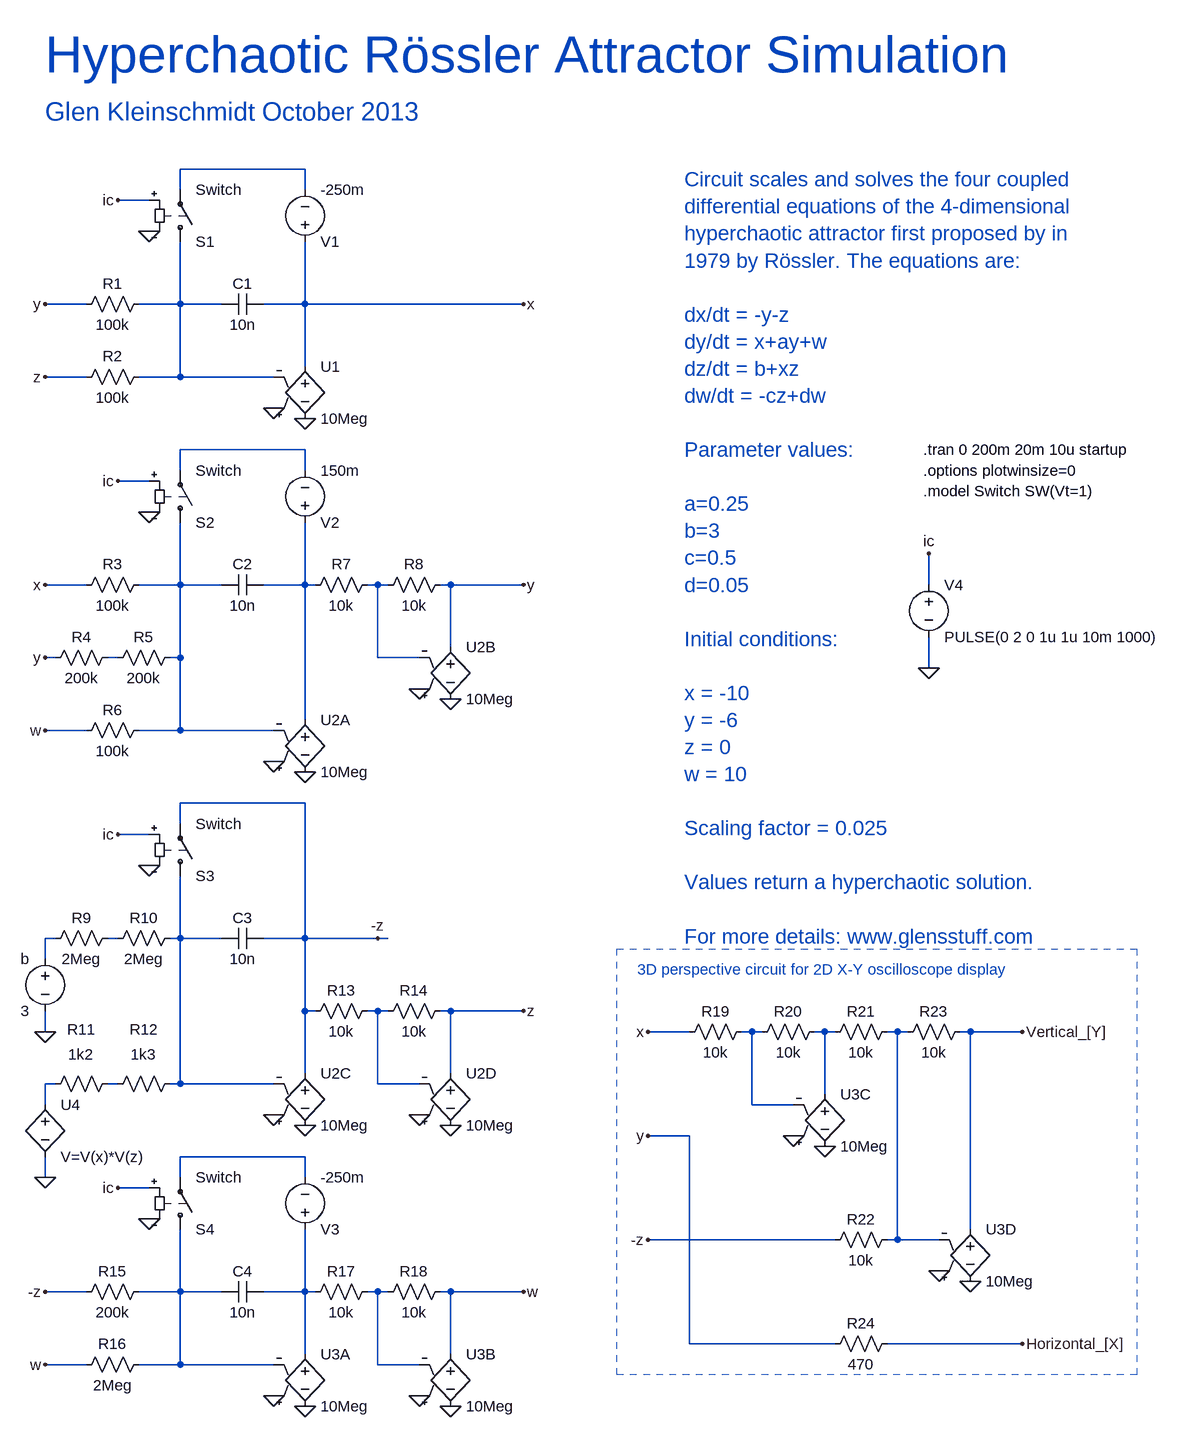
[diagram p0: schematic hyperroessler.asc]
hyperroessler.asc, the LTspice schematic file:
Version 4
SHEET 1 2788 2132
WIRE -912 -32 -1104 -32
WIRE -1104 0 -1104 -32
WIRE -912 0 -912 -32
WIRE -1152 16 -1200 16
WIRE -1248 176 -1312 176
WIRE -1104 176 -1104 80
WIRE -1104 176 -1168 176
WIRE -1040 176 -1104 176
WIRE -912 176 -912 80
WIRE -912 176 -976 176
WIRE -576 176 -912 176
WIRE -912 272 -912 176
WIRE -1248 288 -1312 288
WIRE -1104 288 -1104 176
WIRE -1104 288 -1168 288
WIRE -960 288 -1104 288
WIRE -912 400 -1104 400
WIRE -1104 432 -1104 400
WIRE -912 432 -912 400
WIRE -1152 448 -1200 448
WIRE -1248 608 -1312 608
WIRE -1104 608 -1104 512
WIRE -1104 608 -1168 608
WIRE -1040 608 -1104 608
WIRE -912 608 -912 512
WIRE -912 608 -976 608
WIRE -896 608 -912 608
WIRE -800 608 -816 608
WIRE -784 608 -800 608
WIRE -688 608 -704 608
WIRE -576 608 -688 608
WIRE 48 608 48 560
WIRE -688 704 -688 608
WIRE -1296 720 -1312 720
WIRE -1200 720 -1216 720
WIRE -1104 720 -1104 608
WIRE -1104 720 -1120 720
WIRE -800 720 -800 608
WIRE -736 720 -800 720
WIRE 48 736 48 688
WIRE -912 816 -912 608
WIRE -1248 832 -1312 832
WIRE -1104 832 -1104 720
WIRE -1104 832 -1168 832
WIRE -960 832 -1104 832
WIRE -912 944 -1104 944
WIRE -1104 976 -1104 944
WIRE -1152 992 -1200 992
WIRE -1296 1152 -1312 1152
WIRE -1200 1152 -1216 1152
WIRE -1104 1152 -1104 1056
WIRE -1104 1152 -1120 1152
WIRE -1040 1152 -1104 1152
WIRE -912 1152 -912 944
WIRE -912 1152 -976 1152
WIRE -800 1152 -912 1152
WIRE -784 1152 -800 1152
WIRE -1312 1184 -1312 1152
WIRE -912 1264 -912 1152
WIRE -896 1264 -912 1264
WIRE -800 1264 -816 1264
WIRE -784 1264 -800 1264
WIRE -688 1264 -704 1264
WIRE -576 1264 -688 1264
WIRE -1312 1296 -1312 1264
WIRE -320 1296 -384 1296
WIRE -224 1296 -240 1296
WIRE -208 1296 -224 1296
WIRE -112 1296 -128 1296
WIRE -96 1296 -112 1296
WIRE 0 1296 -16 1296
WIRE 16 1296 0 1296
WIRE 112 1296 96 1296
WIRE 192 1296 112 1296
WIRE -912 1360 -912 1264
WIRE -688 1360 -688 1264
WIRE -1296 1376 -1312 1376
WIRE -1200 1376 -1216 1376
WIRE -1104 1376 -1104 1152
WIRE -1104 1376 -1120 1376
WIRE -960 1376 -1104 1376
WIRE -800 1376 -800 1264
WIRE -736 1376 -800 1376
WIRE -112 1392 -112 1296
WIRE -1312 1408 -1312 1376
WIRE -224 1408 -224 1296
WIRE -160 1408 -224 1408
WIRE -320 1456 -384 1456
WIRE -912 1488 -1104 1488
WIRE -1312 1520 -1312 1488
WIRE -1104 1520 -1104 1488
WIRE -912 1520 -912 1488
WIRE -1152 1536 -1200 1536
WIRE 112 1600 112 1296
WIRE -96 1616 -384 1616
WIRE 0 1616 0 1296
WIRE 0 1616 -16 1616
WIRE 64 1616 0 1616
WIRE -1248 1696 -1312 1696
WIRE -1104 1696 -1104 1600
WIRE -1104 1696 -1168 1696
WIRE -1040 1696 -1104 1696
WIRE -912 1696 -912 1600
WIRE -912 1696 -976 1696
WIRE -896 1696 -912 1696
WIRE -800 1696 -816 1696
WIRE -784 1696 -800 1696
WIRE -688 1696 -704 1696
WIRE -576 1696 -688 1696
WIRE -320 1776 -320 1456
WIRE -96 1776 -320 1776
WIRE 192 1776 -16 1776
WIRE -912 1792 -912 1696
WIRE -688 1792 -688 1696
WIRE -1248 1808 -1312 1808
WIRE -1104 1808 -1104 1696
WIRE -1104 1808 -1168 1808
WIRE -960 1808 -1104 1808
WIRE -800 1808 -800 1696
WIRE -736 1808 -800 1808
FLAG -912 896 0
FLAG -960 880 0
FLAG -688 784 0
FLAG -736 768 0
FLAG -912 352 0
FLAG -960 336 0
FLAG -912 1440 0
FLAG -960 1424 0
FLAG -576 608 y
FLAG -1312 832 w
FLAG -1312 608 x
FLAG -1312 176 y
FLAG -1312 288 z
FLAG -1312 1520 0
FLAG -1312 1296 0
FLAG -1312 720 y
FLAG -688 1440 0
FLAG -736 1424 0
FLAG -576 1264 z
FLAG -912 1872 0
FLAG -960 1856 0
FLAG -688 1872 0
FLAG -736 1856 0
FLAG -576 1696 w
FLAG -1312 1808 w
FLAG -1312 1696 -z
FLAG -800 1152 -z
FLAG -1152 64 0
FLAG 48 736 0
FLAG -1152 496 0
FLAG -1152 1040 0
FLAG -1152 1584 0
FLAG -1200 16 ic
FLAG 48 560 ic
FLAG -1200 448 ic
FLAG -1200 992 ic
FLAG -1200 1536 ic
FLAG -576 176 x
FLAG -384 1296 x
FLAG 192 1296 Vertical_[Y]
FLAG -384 1616 -z
FLAG 192 1776 Horizontal_[X]
FLAG -384 1456 y
FLAG 112 1680 0
FLAG 64 1664 0
FLAG -112 1472 0
FLAG -160 1456 0
SYMBOL e2 -912 800 R0
SYMATTR InstName U2A
SYMATTR Value 10Meg
SYMBOL cap -976 592 R90
WINDOW 0 0 32 VBottom 2
WINDOW 3 32 32 VTop 2
SYMATTR InstName C2
SYMATTR Value 10n
SYMBOL res -1152 592 R90
WINDOW 0 0 56 VBottom 2
WINDOW 3 32 56 VTop 2
SYMATTR InstName R3
SYMATTR Value 100k
SYMBOL res -1152 816 R90
WINDOW 0 0 56 VBottom 2
WINDOW 3 32 56 VTop 2
SYMATTR InstName R6
SYMATTR Value 100k
SYMBOL e2 -688 688 R0
SYMATTR InstName U2B
SYMATTR Value 10Meg
SYMBOL res -800 592 R90
WINDOW 0 0 56 VBottom 2
WINDOW 3 32 56 VTop 2
SYMATTR InstName R7
SYMATTR Value 10k
SYMBOL res -688 592 R90
WINDOW 0 0 56 VBottom 2
WINDOW 3 32 56 VTop 2
SYMATTR InstName R8
SYMATTR Value 10k
SYMBOL e2 -912 256 R0
SYMATTR InstName U1
SYMATTR Value 10Meg
SYMBOL cap -976 160 R90
WINDOW 0 0 32 VBottom 2
WINDOW 3 32 32 VTop 2
SYMATTR InstName C1
SYMATTR Value 10n
SYMBOL res -1152 160 R90
WINDOW 0 0 56 VBottom 2
WINDOW 3 32 56 VTop 2
SYMATTR InstName R1
SYMATTR Value 100k
SYMBOL res -1152 272 R90
WINDOW 0 0 56 VBottom 2
WINDOW 3 32 56 VTop 2
SYMATTR InstName R2
SYMATTR Value 100k
SYMBOL e2 -912 1344 R0
SYMATTR InstName U2C
SYMATTR Value 10Meg
SYMBOL cap -976 1136 R90
WINDOW 0 0 32 VBottom 2
WINDOW 3 32 32 VTop 2
SYMATTR InstName C3
SYMATTR Value 10n
SYMBOL bv -1312 1392 R0
SYMATTR InstName U4
SYMATTR Value V=V(x)*V(z)
SYMBOL res -1200 1360 R90
WINDOW 0 -52 56 VBottom 2
WINDOW 3 -45 57 VTop 2
SYMATTR InstName R11
SYMATTR Value 1k2
SYMBOL res -1200 1136 R90
WINDOW 0 0 56 VBottom 2
WINDOW 3 32 56 VTop 2
SYMATTR InstName R9
SYMATTR Value 2Meg
SYMBOL voltage -1312 1168 M0
WINDOW 123 0 0 Left 2
WINDOW 39 0 0 Left 2
SYMATTR InstName b
SYMATTR Value 3
SYMBOL e2 -688 1344 R0
SYMATTR InstName U2D
SYMATTR Value 10Meg
SYMBOL res -800 1248 R90
WINDOW 0 0 56 VBottom 2
WINDOW 3 32 56 VTop 2
SYMATTR InstName R13
SYMATTR Value 10k
SYMBOL res -688 1248 R90
WINDOW 0 0 56 VBottom 2
WINDOW 3 32 56 VTop 2
SYMATTR InstName R14
SYMATTR Value 10k
SYMBOL e2 -912 1776 R0
SYMATTR InstName U3A
SYMATTR Value 10Meg
SYMBOL cap -976 1680 R90
WINDOW 0 0 32 VBottom 2
WINDOW 3 32 32 VTop 2
SYMATTR InstName C4
SYMATTR Value 10n
SYMBOL res -1152 1680 R90
WINDOW 0 0 56 VBottom 2
WINDOW 3 32 56 VTop 2
SYMATTR InstName R15
SYMATTR Value 200k
SYMBOL res -1152 1792 R90
WINDOW 0 0 56 VBottom 2
WINDOW 3 32 56 VTop 2
SYMATTR InstName R16
SYMATTR Value 2Meg
SYMBOL e2 -688 1776 R0
SYMATTR InstName U3B
SYMATTR Value 10Meg
SYMBOL res -800 1680 R90
WINDOW 0 0 56 VBottom 2
WINDOW 3 32 56 VTop 2
SYMATTR InstName R17
SYMATTR Value 10k
SYMBOL res -688 1680 R90
WINDOW 0 0 56 VBottom 2
WINDOW 3 32 56 VTop 2
SYMATTR InstName R18
SYMATTR Value 10k
SYMBOL sw -1104 96 M180
SYMATTR InstName S1
SYMATTR Value Switch
SYMBOL voltage -912 96 M180
WINDOW 123 0 0 Left 2
WINDOW 39 0 0 Left 2
SYMATTR InstName V1
SYMATTR Value -250m
SYMBOL sw -1104 528 M180
SYMATTR InstName S2
SYMATTR Value Switch
SYMBOL voltage -912 528 M180
WINDOW 123 0 0 Left 2
WINDOW 39 0 0 Left 2
SYMATTR InstName V2
SYMATTR Value 150m
SYMBOL sw -1104 1072 M180
SYMATTR InstName S3
SYMATTR Value Switch
SYMBOL sw -1104 1616 M180
SYMATTR InstName S4
SYMATTR Value Switch
SYMBOL voltage -912 1616 M180
WINDOW 123 0 0 Left 2
WINDOW 39 0 0 Left 2
SYMATTR InstName V3
SYMATTR Value -250m
SYMBOL voltage 48 592 R0
WINDOW 123 0 0 Left 2
WINDOW 39 0 0 Left 2
SYMATTR InstName V4
SYMATTR Value PULSE(0 2 0 1u 1u 10m 1000)
SYMBOL res 112 1280 R90
WINDOW 0 0 56 VBottom 2
WINDOW 3 32 56 VTop 2
SYMATTR InstName R23
SYMATTR Value 10k
SYMBOL res 0 1280 R90
WINDOW 0 0 56 VBottom 2
WINDOW 3 32 56 VTop 2
SYMATTR InstName R21
SYMATTR Value 10k
SYMBOL res 0 1760 R90
WINDOW 0 0 56 VBottom 2
WINDOW 3 32 56 VTop 2
SYMATTR InstName R24
SYMATTR Value 470
SYMBOL e2 112 1584 R0
SYMATTR InstName U3D
SYMATTR Value 10Meg
SYMBOL res -112 1280 R90
WINDOW 0 0 56 VBottom 2
WINDOW 3 32 56 VTop 2
SYMATTR InstName R20
SYMATTR Value 10k
SYMBOL res -224 1280 R90
WINDOW 0 0 56 VBottom 2
WINDOW 3 32 56 VTop 2
SYMATTR InstName R19
SYMATTR Value 10k
SYMBOL e2 -112 1376 R0
SYMATTR InstName U3C
SYMATTR Value 10Meg
SYMBOL res 0 1600 R90
WINDOW 0 0 56 VBottom 2
WINDOW 3 32 56 VTop 2
SYMATTR InstName R22
SYMATTR Value 10k
SYMBOL res -1200 704 R90
WINDOW 0 0 56 VBottom 2
WINDOW 3 32 56 VTop 2
SYMATTR InstName R4
SYMATTR Value 200k
SYMBOL res -1104 704 R90
WINDOW 0 0 56 VBottom 2
WINDOW 3 32 56 VTop 2
SYMATTR InstName R5
SYMATTR Value 200k
SYMBOL res -1104 1136 R90
WINDOW 0 0 56 VBottom 2
WINDOW 3 32 56 VTop 2
SYMATTR InstName R10
SYMATTR Value 2Meg
SYMBOL res -1104 1360 R90
WINDOW 0 -52 56 VBottom 2
WINDOW 3 -45 57 VTop 2
SYMATTR InstName R12
SYMATTR Value 1k3
TEXT 40 400 Left 2 !.tran 0 200m 20m 10u startup
TEXT 40 432 Left 2 !.options plotwinsize=0
TEXT 40 464 Left 2 !.model Switch SW(Vt=1)
TEXT -1312 -208 Left 6 ;Hyperchaotic Rössler Attractor Simulation
TEXT -1312 -120 Left 4 ;Glen Kleinschmidt October 2013
TEXT -328 -16 Left 3 ;Circuit scales and solves the four coupled \ndifferential equations of the 4-dimensional\nhyperchaotic attractor first proposed by in \n1979 by Rössler. The equations are:\n \ndx/dt = -y-z\ndy/dt = x+ay+w\ndz/dt = b+xz\ndw/dt = -cz+dw\n \nParameter values:\n \na=0.25\nb=3\nc=0.5\nd=0.05\n \nInitial conditions:\n \nx = -10\ny = -6\nz = 0\nw = 10\n \nScaling factor = 0.025\n \nValues return a hyperchaotic solution.\n \nFor more details: www.glensstuff.com
TEXT -400 1200 Left 2 ;3D perspective circuit for 2D X-Y oscilloscope display
RECTANGLE Normal 368 1824 -432 1168 2

The netlist it stands for:
* hyperroessler.asc
E§U2A N005 0 0 N004 10Meg
C2 N005 N004 10n
R3 N004 x 100k
R6 N004 w 100k
E§U2B y 0 0 N006 10Meg
R7 N006 N005 10k
R8 y N006 10k
E§U1 x 0 0 N002 10Meg
C1 x N002 10n
R1 N002 y 100k
R2 N002 z 100k
E§U2C -z 0 0 N010 10Meg
C3 -z N010 10n
B§U4 N015 0 V=V(x)*V(z)
R11 N016 N015 1k2
R9 N009 N008 2Meg
V§b N008 0 3
E§U2D z 0 0 N011 10Meg
R13 N011 -z 10k
R14 z N011 10k
E§U3A N019 0 0 N018 10Meg
C4 N019 N018 10n
R15 N018 -z 200k
R16 N018 w 2Meg
E§U3B w 0 0 N020 10Meg
R17 N020 N019 10k
R18 w N020 10k
S1 N002 N001 ic 0 Switch
V1 x N001 -250m
S2 N004 N003 ic 0 Switch
V2 N005 N003 150m
S3 N010 -z ic 0 Switch
S4 N018 N017 ic 0 Switch
V3 N019 N017 -250m
V4 ic 0 PULSE(0 2 0 1u 1u 10m 1000)
R23 Vertical_[Y] N014 10k
R21 N014 N013 10k
R24 Horizontal_[X] y 470
E§U3D Vertical_[Y] 0 0 N014 10Meg
R20 N013 N012 10k
R19 N012 x 10k
E§U3C N013 0 0 N012 10Meg
R22 N014 -z 10k
R4 N007 y 200k
R5 N004 N007 200k
R10 N010 N009 2Meg
R12 N010 N016 1k3
.tran 0 200m 20m 10u startup
.options plotwinsize=0
.model Switch SW(Vt=1)
* Hyperchaotic Rössler Attractor Simulation
* Glen Kleinschmidt October 2013
* Circuit scales and solves the four coupled
* differential equations of the 4-dimensional
* hyperchaotic attractor first proposed by in
* 1979 by Rössler. The equations are:
* dx/dt = -y-z
* dy/dt = x+ay+w
* dz/dt = b+xz
* dw/dt = -cz+dw
* Parameter values:
* a=0.25
* b=3
* c=0.5
* d=0.05
* Initial conditions:
* x = -10
* y = -6
* z = 0
* w = 10
* Scaling factor = 0.025
* Values return a hyperchaotic solution.
* For more details: www.glensstuff.com
* 3D perspective circuit for 2D X-Y oscilloscope display
.backanno
.end